# EasyEDA Pro project ProProject_fpga_cpu_2024-09-28.epro, schematic Schematic1
Create Date: 2024-07-25; Page Name: P1; Project Name: fpga_cpu; Schematic Name: Schematic1; Update Date: 2024-08-17; Company: 嘉立创EDA; Page Size: A4; Version: V1.0
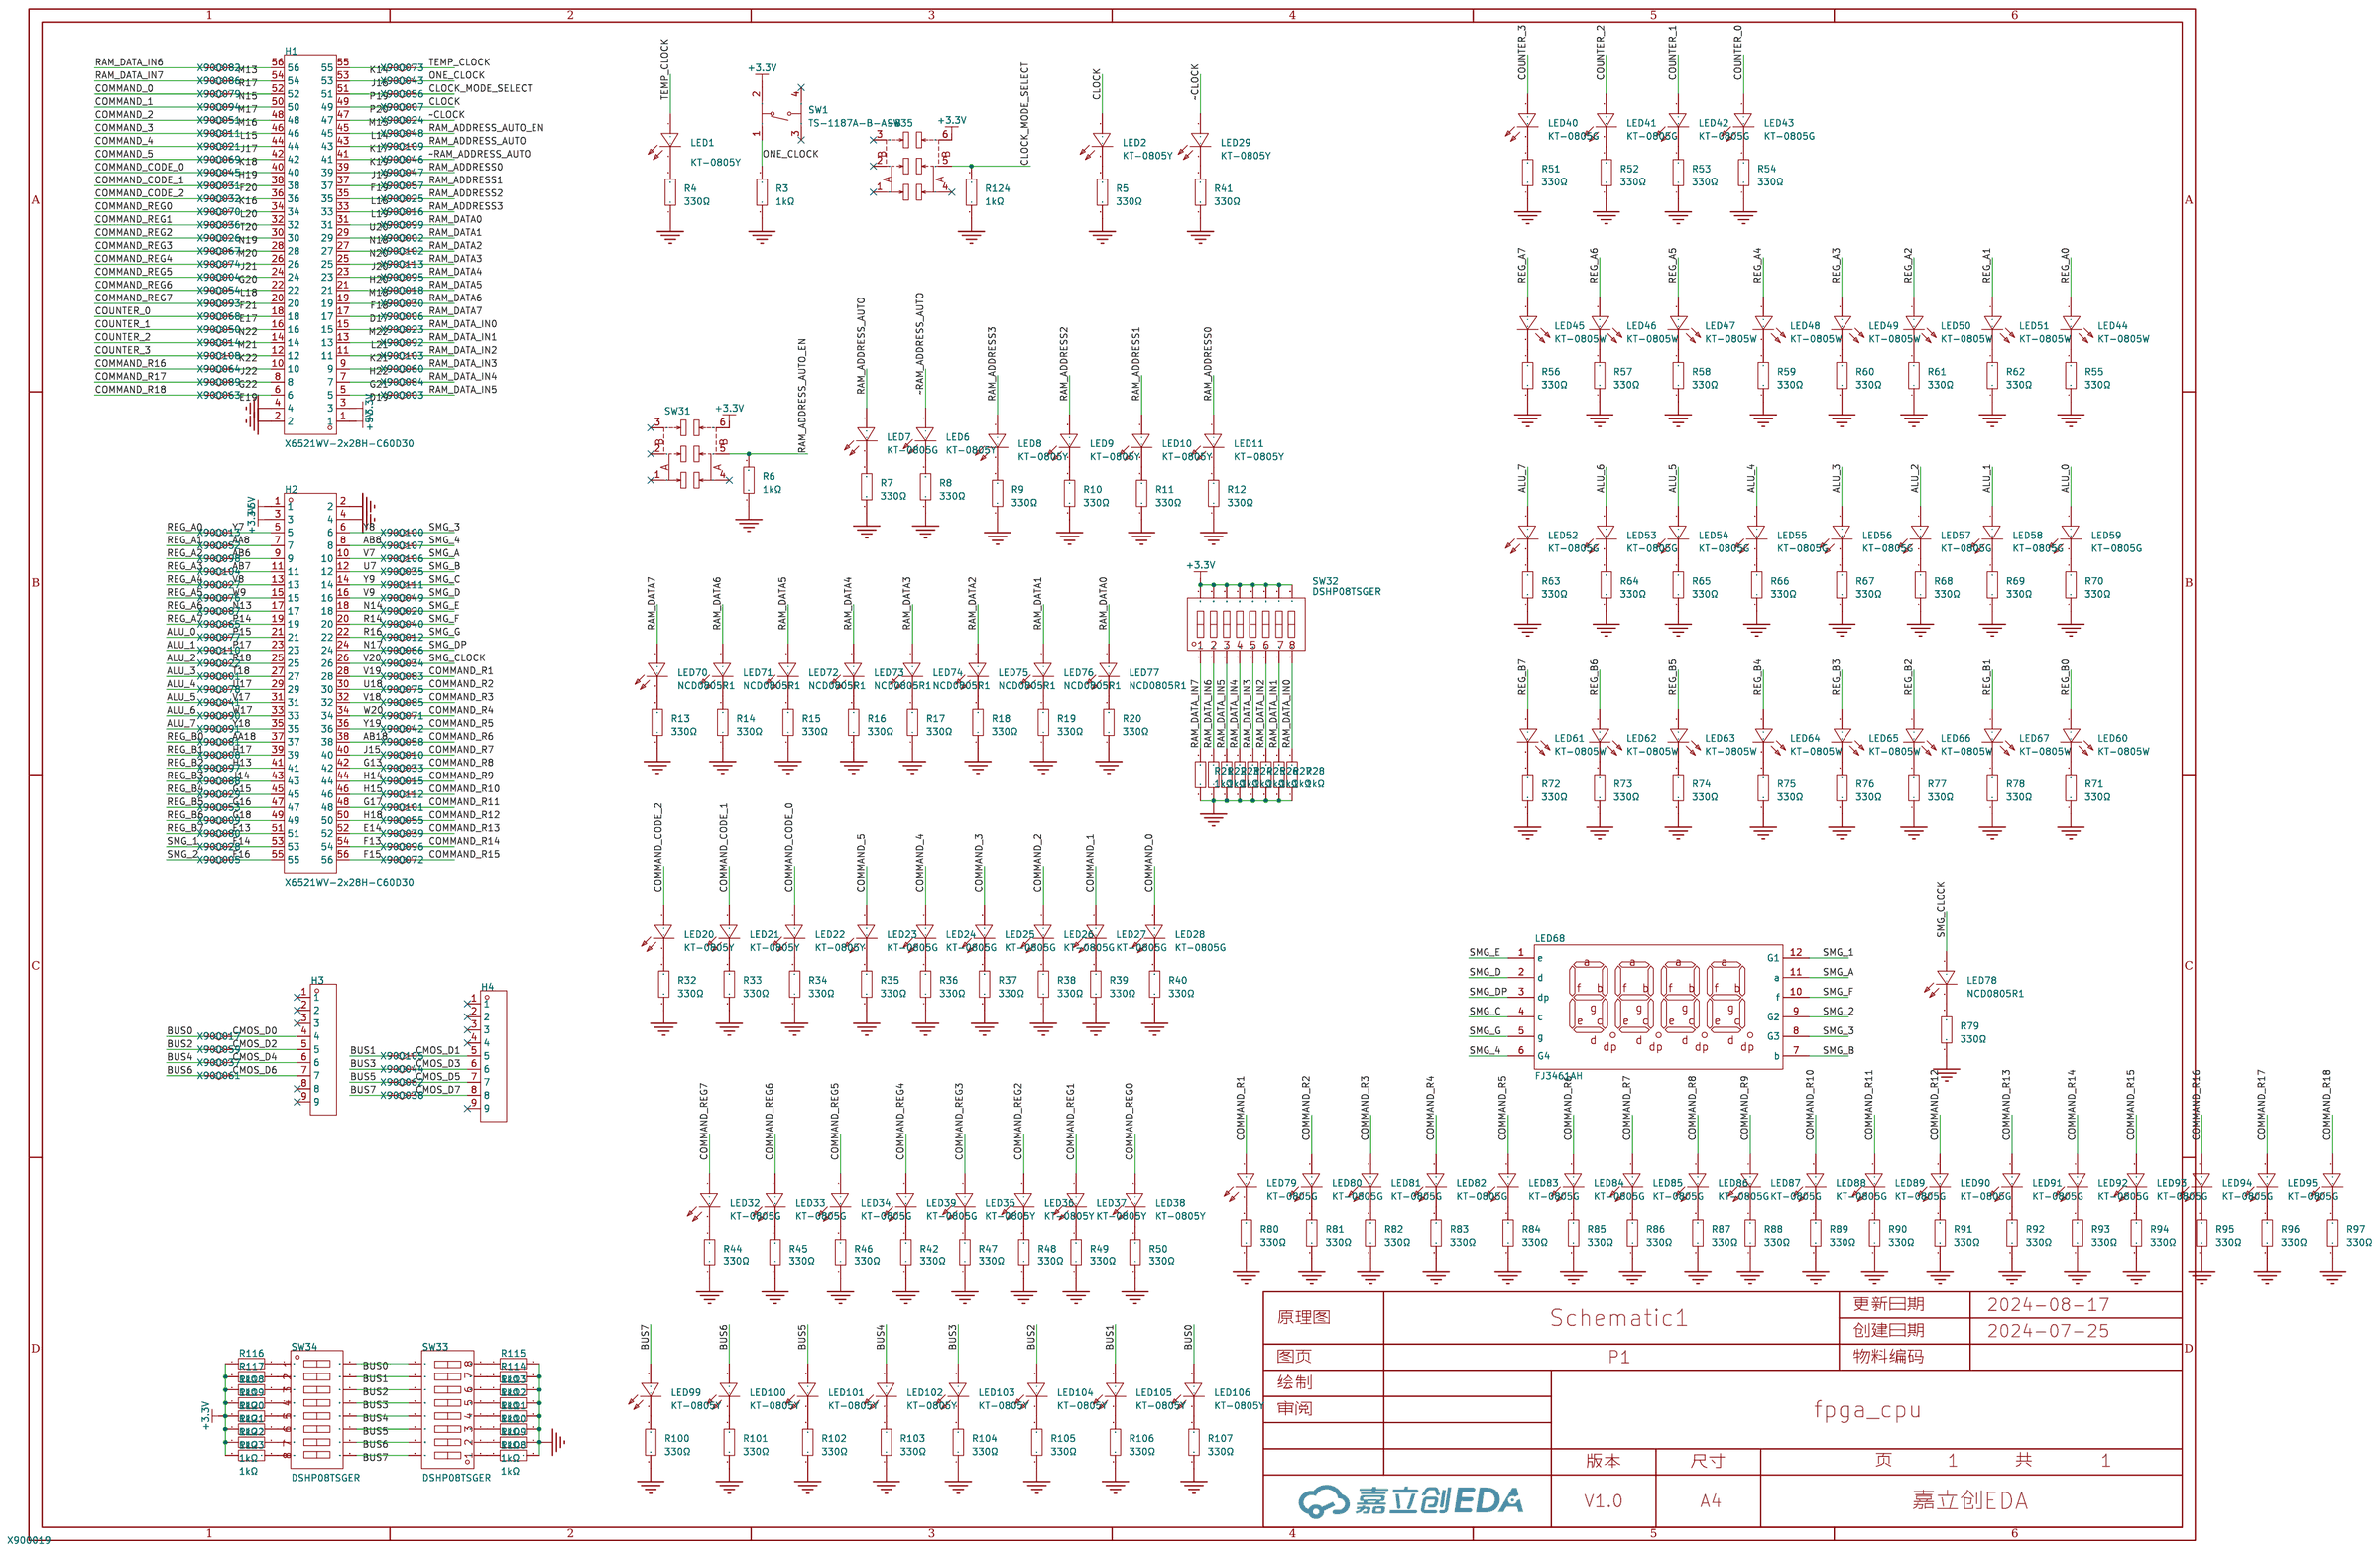
[diagram p1: schematic sheet]

## Parts
H1  X6521WV-2x28H-C60D30  [HDR-TH_56P-2.54-V-M-R2-C28-S2.54]
H2  X6521WV-2x28H-C60D30  [HDR-TH_56P-2.54-V-M-R2-C28-S2.54]
H3  -  [HDR-TH_9P-P2.54-V-M]
H4  -  [HDR-TH_9P-P2.54-V-M]
LED1  KT-0805Y  [LED0805-R-RD]
LED2  KT-0805Y  [LED0805-R-RD]
LED6  KT-0805Y  [LED0805-R-RD]
LED7  KT-0805G  [LED0805-R-RD]
LED8  KT-0805Y  [LED0805-R-RD]
LED9  KT-0805Y  [LED0805-R-RD]
LED10  KT-0805Y  [LED0805-R-RD]
LED11  KT-0805Y  [LED0805-R-RD]
LED20  KT-0805Y  [LED0805-R-RD]
LED21  KT-0805Y  [LED0805-R-RD]
LED22  KT-0805Y  [LED0805-R-RD]
LED23  KT-0805G  [LED0805-R-RD]
LED24  KT-0805G  [LED0805-R-RD]
LED25  KT-0805G  [LED0805-R-RD]
LED26  KT-0805G  [LED0805-R-RD]
LED27  KT-0805G  [LED0805-R-RD]
LED28  KT-0805G  [LED0805-R-RD]
LED29  KT-0805Y  [LED0805-R-RD]
LED32  KT-0805G  [LED0805-R-RD]
LED33  KT-0805G  [LED0805-R-RD]
LED34  KT-0805G  [LED0805-R-RD]
LED35  KT-0805Y  [LED0805-R-RD]
LED36  KT-0805Y  [LED0805-R-RD]
LED37  KT-0805Y  [LED0805-R-RD]
LED38  KT-0805Y  [LED0805-R-RD]
LED39  KT-0805G  [LED0805-R-RD]
LED40  KT-0805G  [LED0805-R-RD]
LED41  KT-0805G  [LED0805-R-RD]
LED42  KT-0805G  [LED0805-R-RD]
LED43  KT-0805G  [LED0805-R-RD]
LED44  KT-0805W  [LED0805-R-RD]
LED45  KT-0805W  [LED0805-R-RD]
LED46  KT-0805W  [LED0805-R-RD]
LED47  KT-0805W  [LED0805-R-RD]
LED48  KT-0805W  [LED0805-R-RD]
LED49  KT-0805W  [LED0805-R-RD]
LED50  KT-0805W  [LED0805-R-RD]
LED51  KT-0805W  [LED0805-R-RD]
LED52  KT-0805G  [LED0805-R-RD]
LED53  KT-0805G  [LED0805-R-RD]
LED54  KT-0805G  [LED0805-R-RD]
LED55  KT-0805G  [LED0805-R-RD]
LED56  KT-0805G  [LED0805-R-RD]
LED57  KT-0805G  [LED0805-R-RD]
LED58  KT-0805G  [LED0805-R-RD]
LED59  KT-0805G  [LED0805-R-RD]
LED60  KT-0805W  [LED0805-R-RD]
LED61  KT-0805W  [LED0805-R-RD]
LED62  KT-0805W  [LED0805-R-RD]
LED63  KT-0805W  [LED0805-R-RD]
LED64  KT-0805W  [LED0805-R-RD]
LED65  KT-0805W  [LED0805-R-RD]
LED66  KT-0805W  [LED0805-R-RD]
LED67  KT-0805W  [LED0805-R-RD]
LED68  FJ3461AH  [LED-SEG-TH_12P-L30.0-W14.0-P2.54-S10.16-BL]
LED70  NCD0805R1  [LED0805-R-RD]
LED71  NCD0805R1  [LED0805-R-RD]
LED72  NCD0805R1  [LED0805-R-RD]
LED73  NCD0805R1  [LED0805-R-RD]
LED74  NCD0805R1  [LED0805-R-RD]
LED75  NCD0805R1  [LED0805-R-RD]
LED76  NCD0805R1  [LED0805-R-RD]
LED77  NCD0805R1  [LED0805-R-RD]
LED78  NCD0805R1  [LED0805-R-RD]
LED79  KT-0805G  [LED0805-R-RD]
LED80  KT-0805G  [LED0805-R-RD]
LED81  KT-0805G  [LED0805-R-RD]
LED82  KT-0805G  [LED0805-R-RD]
LED83  KT-0805G  [LED0805-R-RD]
LED84  KT-0805G  [LED0805-R-RD]
LED85  KT-0805G  [LED0805-R-RD]
LED86  KT-0805G  [LED0805-R-RD]
LED87  KT-0805G  [LED0805-R-RD]
LED88  KT-0805G  [LED0805-R-RD]
LED89  KT-0805G  [LED0805-R-RD]
LED90  KT-0805G  [LED0805-R-RD]
LED91  KT-0805G  [LED0805-R-RD]
LED92  KT-0805G  [LED0805-R-RD]
LED93  KT-0805G  [LED0805-R-RD]
LED94  KT-0805G  [LED0805-R-RD]
LED95  KT-0805G  [LED0805-R-RD]
LED96  KT-0805G  [LED0805-R-RD]
LED99  KT-0805Y  [LED0805-R-RD]
LED100  KT-0805Y  [LED0805-R-RD]
LED101  KT-0805Y  [LED0805-R-RD]
LED102  KT-0805Y  [LED0805-R-RD]
LED103  KT-0805Y  [LED0805-R-RD]
LED104  KT-0805Y  [LED0805-R-RD]
LED105  KT-0805Y  [LED0805-R-RD]
LED106  KT-0805Y  [LED0805-R-RD]
R3  1kΩ  [R0603]
R4  330Ω  [R0603]
R5  330Ω  [R0603]
R6  1kΩ  [R0603]
R7  330Ω  [R0603]
R8  330Ω  [R0603]
R9  330Ω  [R0603]
R10  330Ω  [R0603]
R11  330Ω  [R0603]
R12  330Ω  [R0603]
R13  330Ω  [R0603]
R14  330Ω  [R0603]
R15  330Ω  [R0603]
R16  330Ω  [R0603]
R17  330Ω  [R0603]
R18  330Ω  [R0603]
R19  330Ω  [R0603]
R20  330Ω  [R0603]
R21  1kΩ  [R0603]
R22  1kΩ  [R0603]
R23  1kΩ  [R0603]
R24  1kΩ  [R0603]
R25  1kΩ  [R0603]
R26  1kΩ  [R0603]
R27  1kΩ  [R0603]
R28  1kΩ  [R0603]
R32  330Ω  [R0603]
R33  330Ω  [R0603]
R34  330Ω  [R0603]
R35  330Ω  [R0603]
R36  330Ω  [R0603]
R37  330Ω  [R0603]
R38  330Ω  [R0603]
R39  330Ω  [R0603]
R40  330Ω  [R0603]
R41  330Ω  [R0603]
R42  330Ω  [R0603]
R44  330Ω  [R0603]
R45  330Ω  [R0603]
R46  330Ω  [R0603]
R47  330Ω  [R0603]
R48  330Ω  [R0603]
R49  330Ω  [R0603]
R50  330Ω  [R0603]
R51  330Ω  [R0603]
R52  330Ω  [R0603]
R53  330Ω  [R0603]
R54  330Ω  [R0603]
R55  330Ω  [R0603]
R56  330Ω  [R0603]
R57  330Ω  [R0603]
R58  330Ω  [R0603]
R59  330Ω  [R0603]
R60  330Ω  [R0603]
R61  330Ω  [R0603]
R62  330Ω  [R0603]
R63  330Ω  [R0603]
R64  330Ω  [R0603]
R65  330Ω  [R0603]
R66  330Ω  [R0603]
R67  330Ω  [R0603]
R68  330Ω  [R0603]
R69  330Ω  [R0603]
R70  330Ω  [R0603]
R71  330Ω  [R0603]
R72  330Ω  [R0603]
R73  330Ω  [R0603]
R74  330Ω  [R0603]
R75  330Ω  [R0603]
R76  330Ω  [R0603]
R77  330Ω  [R0603]
R78  330Ω  [R0603]
R79  330Ω  [R0603]
R80  330Ω  [R0603]
R81  330Ω  [R0603]
R82  330Ω  [R0603]
R83  330Ω  [R0603]
R84  330Ω  [R0603]
R85  330Ω  [R0603]
R86  330Ω  [R0603]
R87  330Ω  [R0603]
R88  330Ω  [R0603]
R89  330Ω  [R0603]
R90  330Ω  [R0603]
R91  330Ω  [R0603]
R92  330Ω  [R0603]
R93  330Ω  [R0603]
R94  330Ω  [R0603]
R95  330Ω  [R0603]
R96  330Ω  [R0603]
R97  330Ω  [R0603]
R100  330Ω  [R0603]
R101  330Ω  [R0603]
R102  330Ω  [R0603]
R103  330Ω  [R0603]
R104  330Ω  [R0603]
R105  330Ω  [R0603]
R106  330Ω  [R0603]
R107  330Ω  [R0603]
R108  1kΩ  [R0603]
R109  1kΩ  [R0603]
R110  1kΩ  [R0603]
R111  1kΩ  [R0603]
R112  1kΩ  [R0603]
R113  1kΩ  [R0603]
R114  1kΩ  [R0603]
R115  1kΩ  [R0603]
R116  1kΩ  [R0603]
R117  1kΩ  [R0603]
R118  1kΩ  [R0603]
R119  1kΩ  [R0603]
R120  1kΩ  [R0603]
R121  1kΩ  [R0603]
R122  1kΩ  [R0603]
R123  1kΩ  [R0603]
R124  1kΩ  [R0603]
SW1  TS-1187A-B-A-B  [SW-SMD_4P-L5.1-W5.1-P3.70-LS6.5-TL-2]
SW31  MST22D18G2  [SW-SMD_MST22D18G2]
SW32  DSHP08TSGER  [SW-SMD_16P-L11.7-W5.4-P1.27-LS8.5]
SW33  DSHP08TSGER  [SW-SMD_16P-L11.7-W5.4-P1.27-LS8.5]
SW34  DSHP08TSGER  [SW-SMD_16P-L11.7-W5.4-P1.27-LS8.5]
SW35  MST22D18G2  [SW-SMD_MST22D18G2]

## Library data of the parts
H1 H2 = X6521WV-2x28H-C60D30: 插针结构:2x28P;间距:2.54mm;行距:2.54mm;圆针/方针:方针;安装类型:-;排数:双排;总PIN位数:56P;额定电流:3A;额定电压:250V;配合针长度:-;塑高:2.5mm;端接针长度:-;触头材质:黄铜;触头镀层:金;工作温度范围:-40℃~+105℃;焊接温度(最大值):260℃;颜色:黑色;; LCSC Part Name: 2x28P 间距:2.54mm 方针; Supplier Part: C725900; Manufacturer: XKB Connection(中国星坤); Supplier Footprint: 插件,P=2.54mm; JLCPCB Part Class: 扩展库; Supplier: LCSC; Pin Structure: 2x28P; Pitch: 2.54mm; Row Spacing: 2.54mm; Circluar Pins/Square Pins: 方针; Number of Rows: 双排; Number of Pins: 56P; Current Rating (Max): 3A; Voltage Rating (Max): 250V; Insulation Height: 2.5mm; Contact Material: 黄铜; Contact Plating: 金; Operating Temperature Range: -40℃~+105℃; Soldering Temperature(Max): 260℃; Color: 黑色
H3 H4 = HDR-M_2.54-1x9P: Supplier Part: C492408; Supplier Footprint: 插件
LED1 LED2 LED6 LED8-LED11 LED20-LED22 LED29 LED35-LED38 LED99-LED106 = KT-0805Y: 发光颜色:黄色;功率:-;正向电流:-;主波长:-;二极管配置:-;透镜颜色:-;色温:-;发光角度:-;载带方式:-;工作温度:-;; LCSC Part Name: 0805 黄灯 高亮; Supplier Part: C2296; Manufacturer: KENTO; Supplier Footprint: 0805; JLCPCB Part Class: 基础库; Datasheet: https://atta.szlcsc.com/upload/public/pdf/source/20160421/1461205044170.pdf; Supplier: LCSC; Emitted Color: 黄色
LED7 LED23-LED28 LED32-LED34 LED39-LED43 LED52-LED59 LED79-LED96 = KT-0805G: 灯头类型:-;发光颜色:翠绿色;正向电压(VF):-;功率:-;正向电流:-;主波长:-;二极管配置:-;透镜颜色:-;色温:-;发光强度:-;发光角度:-;载带方式:-;工作温度:-;; LCSC Part Name: 0805 翠绿 高亮; Supplier Part: C2297; Manufacturer: KENTO; Supplier Footprint: 0805; JLCPCB Part Class: 基础库; Datasheet: https://atta.szlcsc.com/upload/public/pdf/source/20170209/1486607340485.pdf; Supplier: LCSC; Emitted Color: 翠绿色
LED44-LED51 LED60-LED67 = KT-0805W: 色温6000K左右; LCSC Part Name: 0805 白灯 高亮; Supplier Part: C34499; Manufacturer: KENTO; Supplier Footprint: 0805; JLCPCB Part Class: 基础库; Datasheet: https://atta.szlcsc.com/upload/public/pdf/source/20221124/DAA20402FFC1FB071B8B6797757426FE.pdf; Supplier: LCSC
LED68 = FJ3461AH: 数码管位数:4位;功耗:-;发光颜色:红色;LED极性:共阴极;数字/字母大小(英寸):0.36;; LCSC Part Name: 4位0.36英寸红色数码管 共阴极; Supplier Part: C10708; Manufacturer: 志浩; Supplier Footprint: 插件; JLCPCB Part Class: 扩展库; Datasheet: https://atta.szlcsc.com/upload/public/pdf/source/20121231/1457706574766.pdf; Supplier: LCSC; Number of Characters: 4位; Module Size: 30mmx14mmx7.2mm; Luminous Color: 红色; LED Polarity: 共阴极; Digit/Alpha Size(inch): 0.36
LED70-LED78 = NCD0805R1: 灯头类型:-;发光颜色:红色;正向电压(VF):1.6V~2.6V;功率:65mW;正向电流:20mA;主波长:615nm~630nm;二极管配置:独立二极管;透镜颜色:无色透明透镜;色温:-;发光强度:67mcd~195mcd;发光角度:130°;载带方式:-;工作温度:-30℃~+85℃;; Supplier Part: C84256; Manufacturer: 国星光电; Supplier Footprint: 0805; JLCPCB Part Class: 基础库; Datasheet: https://atta.szlcsc.com/upload/public/pdf/source/20200820/C84256_F0A75A43B3EAD75808600A0514C76B99.pdf; Supplier: LCSC; Emitted Color: 红色; Forward Voltage (VF): 1.6V~2.6V; Power Dissipation: 65mW; Forward Current: 20mA; Dominant Wavelength: 615nm~630nm; Diode Configuration: 独立二极管; Lens Color: 无色透明透镜; Luminous Intensity: 67mcd~195mcd; Viewing Angle: 130°; Operating Temperature: -30℃~+85℃
R3 R6 R21-R28 R108-R124 = 0603WAF1001T5E: 电阻类型:厚膜电阻;阻值:1kΩ;精度:±1%;功率:100mW;最大工作电压:75V;温度系数:±100ppm/℃;; LCSC Part Name: 1kΩ ±1% 100mW 厚膜电阻; Supplier Part: C21190; Manufacturer: UNI-ROYAL(厚声); Supplier Footprint: 0603; JLCPCB Part Class: 基础库; Datasheet: https://atta.szlcsc.com/upload/public/pdf/source/20200306/C422600_1E6D84923E4A46A82E41ADD87F860B5C.pdf; Supplier: LCSC; Type: 厚膜电阻; Tolerance: ±1%; Power(Watts): 100mW; Overload Voltage (Max): 75V; Temperature Coefficient: ±100ppm/℃; Operating Temperature Range: -55℃~+155℃
R4 R5 R7-R20 R32-R42 R44-R97 R100-R107 = 0603WAF3300T5E: 电阻类型:厚膜电阻;阻值:330Ω;精度:±1%;功率:100mW;最大工作电压:75V;温度系数:±100ppm/℃;; LCSC Part Name: 330Ω ±1% 100mW 厚膜电阻; Supplier Part: C23138; Manufacturer: UNI-ROYAL(厚声); Supplier Footprint: 0603; JLCPCB Part Class: 基础库; Datasheet: https://atta.szlcsc.com/upload/public/pdf/source/20200306/C422600_1E6D84923E4A46A82E41ADD87F860B5C.pdf; Supplier: LCSC; Type: 厚膜电阻; Tolerance: ±1%; Power(Watts): 100mW; Overload Voltage (Max): 75V; Temperature Coefficient: ±100ppm/℃; Operating Temperature Range: -55℃~+155℃
SW1 = TS-1187A-B-A-B: 电路结构:单刀单掷;按钮形状:圆形按钮;作用力:160gf;安装方式:立贴;开关长度:5.1mm;开关宽度:5.1mm;开关高度:1.5mm;带支架:不带;触点电流:50mA;额定电压(DC):12V;绝缘电阻:-;带灯:无;机械寿命:10万次;; LCSC Part Name: 5.1*5.1*1.5mm 立贴 轻触开关; Supplier Part: C318884; Manufacturer: XKB Connectivity(中国星坤); Supplier Footprint: SMD; JLCPCB Part Class: 基础库; Datasheet: https://atta.szlcsc.com/upload/public/pdf/source/20200227/C318890_053E50208A88A7BA1965D8746000774E.pdf; Supplier: LCSC; Circuit: 单刀单掷; Actuator Style: 圆形按钮; Operating Force: 160gf; Mounting Style: 立贴; Switch Length: 5.1mm; Switch Width: 5.1mm; Switch Height: 1.5mm; Strike Gundam: 不带; Contact Current: 50mA; Voltage Rating (DC): 12V; Actuator/Cap Color: 金色; With Lamp: 无; Mechanical Life: 10万次; Operating Temperature: -30℃~+85℃
SW31 SW35 = MST22D18G2: 额定电流(DC)：50mA 额定电压(DC)：12V 电路结构：单刀双掷 安装方式：立贴 机械寿命：10000 滑钮形状：矩形柱状 引脚样式：SMD接片 工作温度：-30℃~+80℃ 开关长度：9.1mm 开关宽度：3.6mm 开关高度：3.45mm 柄高：2mm; LCSC Part Name: 两档立式贴片 6脚拨动 柄长2.0MM; Supplier Part: C431544; Manufacturer: SHOU HAN(首韩); Supplier Footprint: SMD,3.6x9.1mm; JLCPCB Part Class: 扩展库; Datasheet: https://atta.szlcsc.com/upload/public/pdf/source/20190925/C431544_D32DFFD935A96A6C5145903882D4ABA1.pdf; Supplier: LCSC
SW32-SW34 = DSHP08TSGER: 电路结构:单刀单掷;开关位数:8位;额定电流:25mA;额定电压:24V;使用寿命:3千次;颜色:黑色;; LCSC Part Name: 8位 1.27mm脚距贴片型 KE拨码开关 拨动开关; Supplier Part: C3293147; Manufacturer: 康深; Supplier Footprint: SMD-16P,5.4x11.7mm; JLCPCB Part Class: 扩展库; Datasheet: https://atta.szlcsc.com/upload/public/pdf/source/20220713/22525EA437E8BDBA6DC20D0B6C422A83.pdf; Supplier: LCSC; Circuit: 单刀单掷; Number of Positions: 8位; Lead Pitch: 1.27mm; Current Rating: 25mA; Voltage Rating: 24V; Operating Temperature: -30℃~+85℃; Operating Life: 3千次; Color: 黑色

## Nets
+3.3V: H1.3 H2.3 R116.1 R117.1 R118.1 R119.1 R120.1 R121.1 R122.1 R123.1 SW1.2(B) SW31.6 SW32.9(PIN9) SW32.10(PIN10) SW32.11(PIN11) SW32.12(PIN12) SW32.13(PIN13) SW32.14(PIN14) SW32.15 SW32.16 SW35.6
+5V: H1.1 H2.1
GND: H1.2 H1.4 H2.2 H2.4 R3.1 R4.1 R5.1 R6.1 R7.1 R8.1 R9.1 R10.1 R11.1 R12.1 R13.1 R14.1 R15.1 R16.1 R17.1 R18.1 R19.1 R20.1 R21.1 R22.1 R23.1 R24.1 R25.1 R26.1 R27.1 R28.1 R32.1 R33.1 R34.1 R35.1 R36.1 R37.1 R38.1 R39.1 R40.1 R41.1 R42.1 R44.1 R45.1 R46.1 R47.1 R48.1 R49.1 R50.1 R51.1 R52.1 R53.1 R54.1 R55.1 R56.1 R57.1 R58.1 R59.1 R60.1 R61.1 R62.1 R63.1 R64.1 R65.1 R66.1 R67.1 R68.1 R69.1 R70.1 R71.1 R72.1 R73.1 R74.1 R75.1 R76.1 R77.1 R78.1 R79.1 R80.1 R81.1 R82.1 R83.1 R84.1 R85.1 R86.1 R87.1 R88.1 R89.1 R90.1 R91.1 R92.1 R93.1 R94.1 R95.1 R96.1 R97.1 R100.1 R101.1 R102.1 R103.1 R104.1 R105.1 R106.1 R107.1 R108.1 R109.1 R110.1 R111.1 R112.1 R113.1 R114.1 R115.1 R124.1
AA8: H2.7 LED51.1(A)
AA18: H2.37 LED60.1(A)
AB6: H2.9 LED50.1(A)
AB7: H2.11 LED49.1(A)
AB8: H2.8 LED68.6(G4)
AB18: H2.38 LED84.1(A)
ALU_0: H2.21 LED59.1(A)
ALU_1: H2.23 LED58.1(A)
ALU_2: H2.25 LED57.1(A)
ALU_3: H2.27 LED56.1(A)
ALU_4: H2.29 LED55.1(A)
ALU_5: H2.31 LED54.1(A)
ALU_6: H2.33 LED53.1(A)
ALU_7: H2.35 LED52.1(A)
BUS0: H3.4 LED106.1(+) SW33.16 SW34.9(PIN9)
BUS1: H4.5 LED105.1(+) SW33.15 SW34.10(PIN10)
BUS2: H3.5 LED104.1(+) SW33.14(PIN14) SW34.11(PIN11)
BUS3: H4.6 LED103.1(+) SW33.13(PIN13) SW34.12(PIN12)
BUS4: H3.6 LED102.1(+) SW33.12(PIN12) SW34.13(PIN13)
BUS5: H4.7 LED101.1(+) SW33.11(PIN11) SW34.14(PIN14)
BUS6: H3.7 LED100.1(+) SW33.10(PIN10) SW34.15
BUS7: H4.8 LED99.1(+) SW33.9(PIN9) SW34.16
CLOCK: H1.49 LED2.1(+)
CLOCK_MODE_SELECT: H1.51 R124.2 SW35.5
COMMAND_0: H1.52 LED28.1(A)
COMMAND_1: H1.50 LED27.1(A)
COMMAND_2: H1.48 LED26.1(A)
COMMAND_3: H1.46 LED25.1(A)
COMMAND_4: H1.44 LED24.1(A)
COMMAND_5: H1.42 LED23.1(A)
COMMAND_CODE_0: H1.40 LED22.1(+)
COMMAND_CODE_1: H1.38 LED21.1(+)
COMMAND_CODE_2: H1.36 LED20.1(+)
COMMAND_R1: H2.28 LED79.1(A)
COMMAND_R2: H2.30 LED80.1(A)
COMMAND_R3: H2.32 LED81.1(A)
COMMAND_R4: H2.34 LED82.1(A)
COMMAND_R5: H2.36 LED83.1(A)
COMMAND_R7: H2.40 LED85.1(A)
COMMAND_R8: H2.42 LED86.1(A)
COMMAND_R9: H2.44 LED87.1(A)
COMMAND_R10: H2.46 LED88.1(A)
COMMAND_R11: H2.48 LED89.1(A)
COMMAND_R12: H2.50 LED90.1(A)
COMMAND_R13: H2.52 LED91.1(A)
COMMAND_R14: H2.54 LED92.1(A)
COMMAND_R15: H2.56 LED93.1(A)
COMMAND_R16: H1.10 LED94.1(A)
COMMAND_R17: H1.8 LED95.1(A)
COMMAND_R18: H1.6 LED96.1(A)
COMMAND_REG0: H1.34 LED38.1(+)
COMMAND_REG1: H1.32 LED37.1(+)
COMMAND_REG2: H1.30 LED36.1(+)
COMMAND_REG3: H1.28 LED35.1(+)
COMMAND_REG4: H1.26 LED39.1(A)
COMMAND_REG5: H1.24 LED34.1(A)
COMMAND_REG6: H1.22 LED33.1(A)
COMMAND_REG7: H1.20 LED32.1(A)
COUNTER_0: H1.18 LED43.1(A)
COUNTER_1: H1.16 LED42.1(A)
COUNTER_2: H1.14 LED41.1(A)
COUNTER_3: H1.12 LED40.1(A)
D17: H1.17 LED70.1(+)
D19: H1.5 R23.2 SW32.3(PIN3)
E13: H2.51 LED61.1(A)
F14: H2.53 LED68.12(G1)
F16: H2.55 LED68.9(G2)
F18: H1.19 LED71.1(+)
F19: H1.37 LED10.1(+)
G15: H2.45 LED64.1(A)
G16: H2.47 LED63.1(A)
G18: H2.49 LED62.1(A)
G21: H1.7 R24.2 SW32.4(PIN4)
H13: H2.41 LED66.1(A)
H17: H2.39 LED67.1(A)
H20: H1.23 LED73.1(+)
H22: H1.9 R25.2 SW32.5(PIN5)
J14: H2.43 LED65.1(A)
J16: H1.53 R3.2 SW1.1(A)
J19: H1.39 LED11.1(+)
J20: H1.25 LED74.1(+)
K14: H1.55 LED1.1(+)
K17: H1.43 LED7.1(A)
K19: H1.41 LED6.1(+)
K21: H1.11 R26.2 SW32.6(PIN6)
L14: H1.45 R6.2 SW31.5
L16: H1.35 LED9.1(+)
L19: H1.33 LED8.1(+)
L21: H1.13 R27.2 SW32.7(PIN7)
M13: H1.56 R22.2 SW32.2(PIN2)
M15: H1.47 LED29.1(+)
M18: H1.21 LED72.1(+)
M22: H1.15 R28.2 SW32.8(PIN8)
N13: H2.17 LED46.1(A)
N14: H2.18 LED68.1(e)
N17: H2.24 LED68.3(dp)
N18: H1.29 LED76.1(+)
N20: H1.27 LED75.1(+)
P14: H2.19 LED45.1(A)
R14: H2.20 LED68.10(f)
R16: H2.22 LED68.5(g)
R17: H1.54 R21.2 SW32.1(PIN1)
RAM_DATA0: H1.31 LED77.1(+)
REG_A0: H2.5 LED44.1(A)
REG_A4: H2.13 LED48.1(A)
REG_A5: H2.15 LED47.1(A)
SMG_3: H2.6 LED68.8(G3)
SMG_A: H2.10 LED68.11(a)
SMG_B: H2.12 LED68.7(b)
SMG_C: H2.14 LED68.4(c)
SMG_CLOCK: H2.26 LED78.1(+)
SMG_D: H2.16 LED68.2(d)
$1N2814: LED1.2(-) R4.2
$1N2853: LED2.2(-) R5.2
$1N3278: LED7.2(K) R7.2
$1N3330: LED6.2(-) R8.2
$1N3426: LED8.2(-) R9.2
$1N3572: LED9.2(-) R10.2
$1N3668: LED10.2(-) R11.2
$1N3764: LED11.2(-) R12.2
$1N7060: LED20.2(-) R32.2
$1N7156: LED21.2(-) R33.2
$1N7252: LED22.2(-) R34.2
$1N7364: LED23.2(K) R35.2
$1N7463: LED24.2(K) R36.2
$1N7562: LED25.2(K) R37.2
$1N7661: LED26.2(K) R38.2
$1N7760: LED27.2(K) R39.2
$1N7859: LED28.2(K) R40.2
$1N7982: LED29.2(-) R41.2
$1N8372: LED32.2(K) R44.2
$1N8471: LED33.2(K) R45.2
$1N8570: LED34.2(K) R46.2
$1N8666: LED35.2(-) R47.2
$1N8762: LED36.2(-) R48.2
$1N8858: LED37.2(-) R49.2
$1N8954: LED38.2(-) R50.2
$1N9036: LED39.2(K) R42.2
$1N9132: LED40.2(K) R51.2
$1N9231: LED41.2(K) R52.2
$1N9330: LED42.2(K) R53.2
$1N9429: LED43.2(K) R54.2
$1N9531: LED44.2(K) R55.2
$1N9616: LED45.2(K) R56.2
$1N9781: LED46.2(K) R57.2
$1N9785: LED47.2(K) R58.2
$1N10111: LED48.2(K) R59.2
$1N10115: LED49.2(K) R60.2
$1N10119: LED50.2(K) R61.2
$1N10123: LED51.2(K) R62.2
$1N10258: LED52.2(K) R63.2
$1N10357: LED53.2(K) R64.2
$1N10550: LED54.2(K) R65.2
$1N10554: LED55.2(K) R66.2
$1N10936: LED56.2(K) R67.2
$1N10940: LED57.2(K) R68.2
$1N10944: LED58.2(K) R69.2
$1N10948: LED59.2(K) R70.2
$1N11630: LED60.2(K) R71.2
$1N11634: LED61.2(K) R72.2
$1N11638: LED62.2(K) R73.2
$1N11642: LED63.2(K) R74.2
$1N11646: LED64.2(K) R75.2
$1N11650: LED65.2(K) R76.2
$1N11654: LED66.2(K) R77.2
$1N11658: LED67.2(K) R78.2
$1N12273: LED70.2(-) R13.2
$1N12319: LED71.2(-) R14.2
$1N12409: LED73.2(-) R16.2
$1N12411: LED72.2(-) R15.2
$1N12501: LED75.2(-) R18.2
$1N12503: LED74.2(-) R17.2
$1N12593: LED77.2(-) R20.2
$1N12595: LED76.2(-) R19.2
$1N12687: LED78.2(-) R79.2
$1N12783: LED79.2(K) R80.2
$1N12882: LED80.2(K) R81.2
$1N13075: LED81.2(K) R82.2
$1N13079: LED82.2(K) R83.2
$1N13657: LED83.2(K) R84.2
$1N13661: LED84.2(K) R85.2
$1N13665: LED85.2(K) R86.2
$1N13669: LED86.2(K) R87.2
$1N14429: LED87.2(K) R88.2
$1N14433: LED88.2(K) R89.2
$1N14437: LED89.2(K) R90.2
$1N14441: LED90.2(K) R91.2
$1N14445: LED91.2(K) R92.2
$1N14449: LED92.2(K) R93.2
$1N14453: LED93.2(K) R94.2
$1N14457: LED94.2(K) R95.2
$1N14845: LED95.2(K) R96.2
$1N14849: LED96.2(K) R97.2
$1N15037: LED99.2(-) R100.2
$1N15133: LED100.2(-) R101.2
$1N15320: LED101.2(-) R102.2
$1N15324: LED102.2(-) R103.2
$1N15694: LED103.2(-) R104.2
$1N15698: LED104.2(-) R105.2
$1N15702: LED105.2(-) R106.2
$1N15706: LED106.2(-) R107.2
$1N16057: R108.2 SW33.1(PIN1)
$1N16059: R109.2 SW33.2(PIN2)
$1N16061: R110.2 SW33.3(PIN3)
$1N16063: R111.2 SW33.4(PIN4)
$1N16065: R112.2 SW33.5(PIN5)
$1N16067: R113.2 SW33.6(PIN6)
$1N16069: R114.2 SW33.7(PIN7)
$1N16071: R115.2 SW33.8(PIN8)
$1N16464: R116.2 SW34.1(PIN1)
$1N16466: R117.2 SW34.2(PIN2)
$1N16468: R118.2 SW34.3(PIN3)
$1N16470: R119.2 SW34.4(PIN4)
$1N16472: R120.2 SW34.5(PIN5)
$1N16474: R121.2 SW34.6(PIN6)
$1N16476: R122.2 SW34.7(PIN7)
$1N16478: R123.2 SW34.8(PIN8)

Not connected (* = marked no-connect by the designer): H3 1* 2* 3* 8* 9*; H4 1* 2* 3* 4* 9*; SW1 3(C)* 4(D)*; SW31 1* 2* 3* 4*; SW35 1* 2* 3* 4*
